# Altium schematic sheet Connector.SchDoc
size 177 x 114 mm
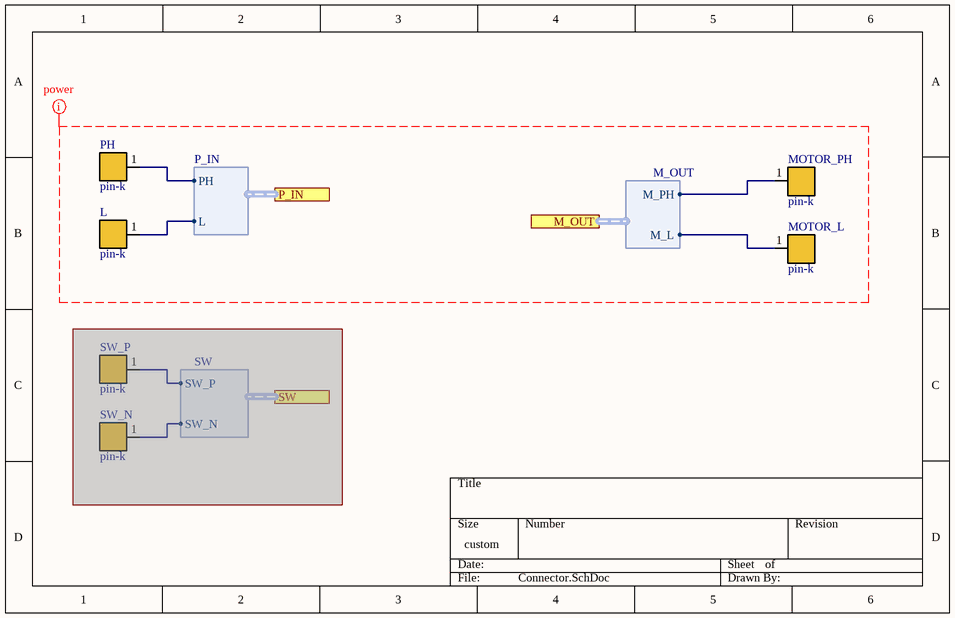
[diagram p0: Connector.SchDoc]

## Parts
L  pin-k  [pin_k]
MOTOR_L  pin-k  [pin_k]
MOTOR_PH  pin-k  [pin_k]
PH  pin-k  [pin_k]
SW_N  pin-k  [pin_k]  (masked out: inside a compile mask, not in the netlist)
SW_P  pin-k  [pin_k]  (masked out: inside a compile mask, not in the netlist)

## Ports
M_OUT (harness M_OUT), P_IN (harness P_IN), SW (harness SW)

## Harnesses
P_IN: PH, L
M_OUT: M_L, M_PH
SW: SW_P, SW_N

## Nets
NetL_1: L.1 ; port P_IN.L
NetMOTOR_L_1: MOTOR_L.1 ; port M_OUT.M_L
NetMOTOR_PH_1: MOTOR_PH.1 ; port M_OUT.M_PH
NetPH_1: PH.1 ; port P_IN.PH

## Layout directives
net class power: (no net found under the mark)